# EAGLE board robo1rev2 (EAGLE 8.2.1)
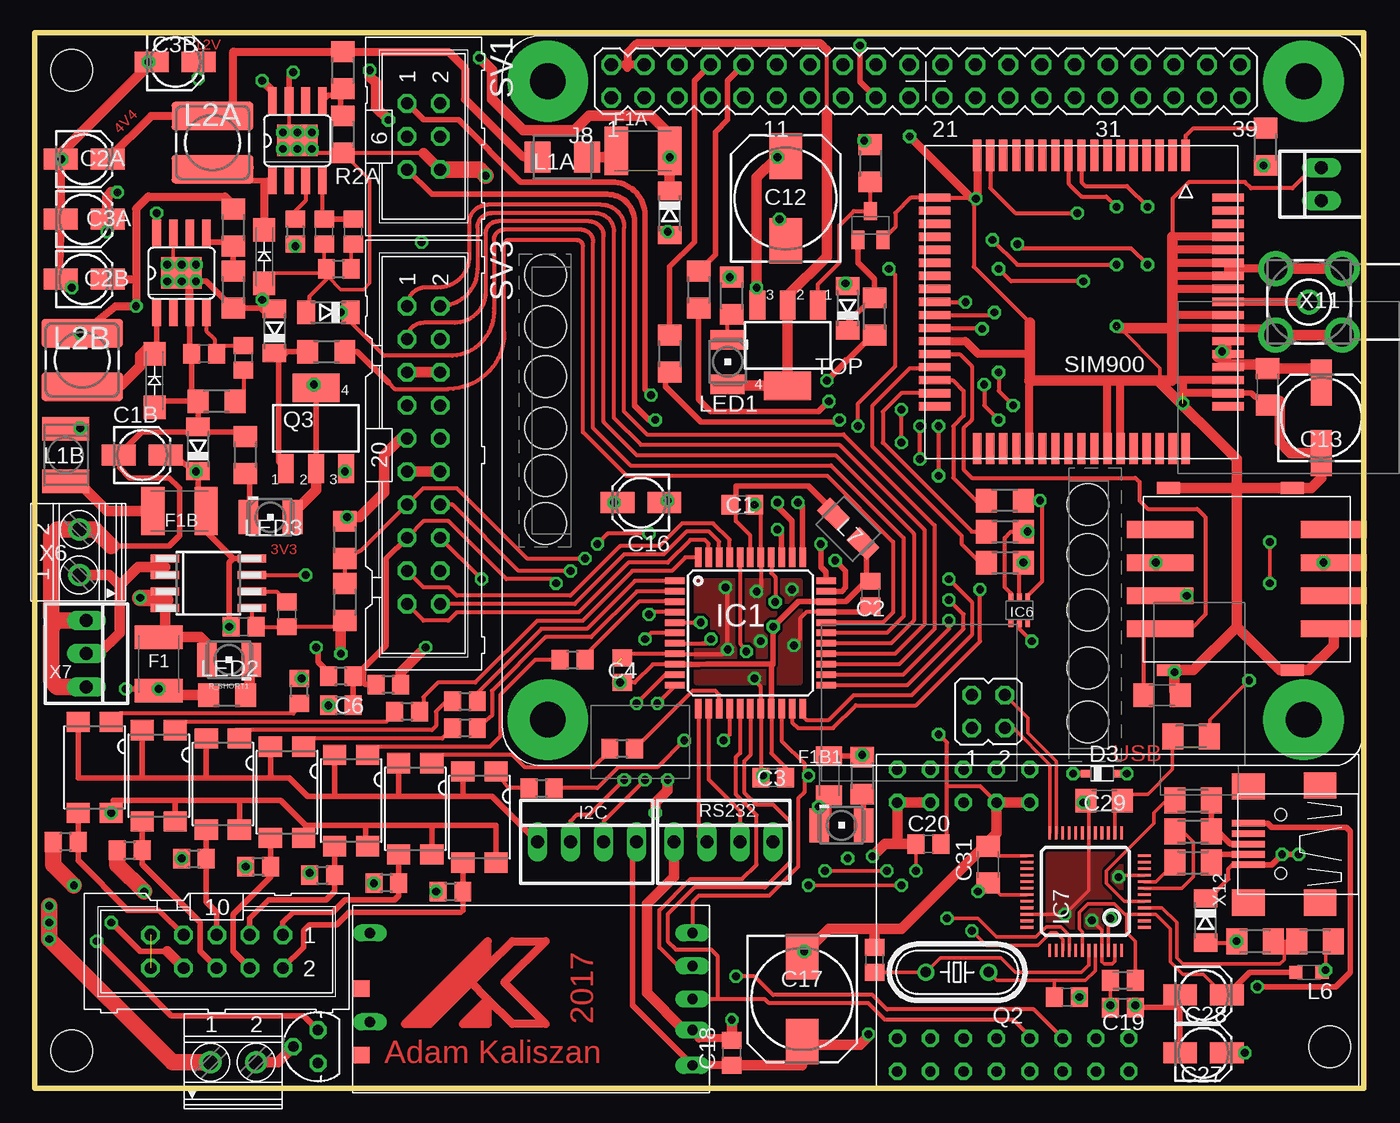
[diagram p2: board, top side]
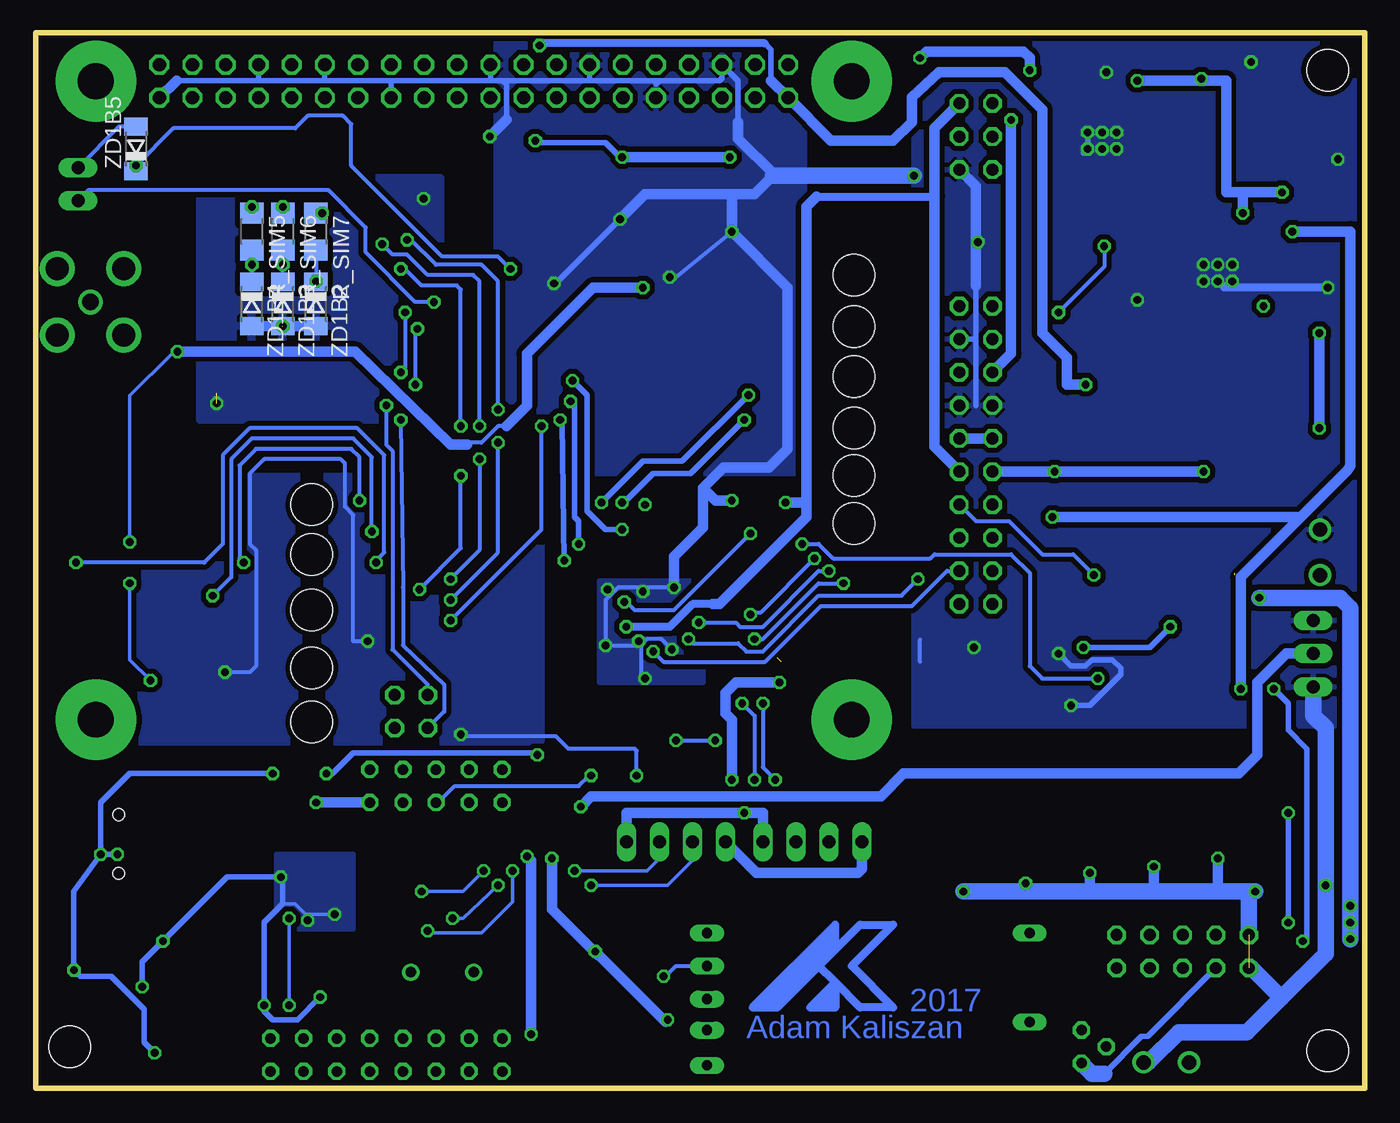
[diagram p3: board, bottom side, seen from below]

Size 102 x 81 mm. Coordinates in mm from the lower left corner, seen from the top.
Outline: 0,0 102,0 102,81 0,81 0,0
Copper layers (1*16): Top 0.035mm / dielectric 1.5mm / Bottom 0.035mm
Design rules "default *": minimum track width 10mil, minimum drill 22mil, track to track 8mil, track to pad 8mil, pad to pad 8mil, via to via 8mil, smd to smd 0mil, copper to edge 8mil, drill to drill 8mil, minimum pad ring 10mil, minimum via ring 8mil, stop-mask expansion 4mil, vias tented up to drill 10mil, thermal gap 10mil
Holes 3.2 mm at 2.86,78.11 2.86,2.86 99.38,3.17 39.21,62.39 39.21,58.42 39.21,54.61 39.21,50.64 39.21,46.99 39.21,43.34 80.8,44.77 80.8,40.96 80.8,36.67 80.8,32.23 80.8,28.1

## Footprints (pad centres in the part's own frame; a part is rotated, then mirrored left to right if it is on the bottom)
C0805 = smd 1.3 x 1.5: 1 -0.95,0; 2 0.95,0
153CLV-0405 = smd 2.6 x 1.6: + 1.8,0; - -1.8,0
C1206 = smd 1.6 x 1.8: 1 -1.4,0; 2 1.4,0
140CLH-0810 = smd 3.5 x 2.5: + 3.25,0; - -3.25,0
153CLV-0605 = smd 3.5 x 1.6: + 2.7,0; - -2.7,0
SMA-DO214AC = smd 1.8 x 1.7: A -2.05,0; K 2.05,0
SOD323_ST = smd 0.8 x 0.6: A 1.25,0; C -1.25,0
C1812K = smd 1.8 x 3.7: 1 -2.05,0; 2 2.05,0
C1206K = smd 1.5 x 2: 1 -1.5,0; 2 1.5,0
22-23-2041 = drill 1 long: 1 -3.81,0; 2 -1.27,0; 3 1.27,0; 4 3.81,0
TQFP44 = smd 1.5 x 0.5: 1 -5.8,4; 2 -5.8,3.2; 3 -5.8,2.4; 4 -5.8,1.6; 5 -5.8,0.8; 6 -5.8,0; 7 -5.8,-0.8; 8 -5.8,-1.6; 9 -5.8,-2.4; 10 -5.8,-3.2; 11 -5.8,-4; 23 5.8,-4; 24 5.8,-3.2; 25 5.8,-2.4; 26 5.8,-1.6; 27 5.8,-0.8; 28 5.8,0; 29 5.8,0.8; 30 5.8,1.6; 31 5.8,2.4; 32 5.8,3.2; 33 5.8,4 | smd 0.5 x 1.5: 12 -4,-5.8; 13 -3.2,-5.8; 14 -2.4,-5.8; 15 -1.6,-5.8; 16 -0.8,-5.8; 17 0,-5.8; 18 0.8,-5.8; 19 1.6,-5.8; 20 2.4,-5.8; 21 3.2,-5.8; 22 4,-5.8; 34 4,5.8; 35 3.2,5.8; 36 2.4,5.8; 37 1.6,5.8; 38 0.8,5.8; 39 0,5.8; 40 -0.8,5.8; 41 -1.6,5.8; 42 -2.4,5.8; 43 -3.2,5.8; 44 -4,5.8
SIM900 = smd 2.413 x 0.635: 1 -11.25,8; 2 -11.25,7; 3 -11.25,6; 4 -11.25,5; 5 -11.25,4; 6 -11.25,3; 7 -11.25,2; 8 -11.25,1; 9 -11.25,0; 10 -11.25,-1; 11 -11.25,-2; 12 -11.25,-3; 13 -11.25,-4; 14 -11.25,-5; 15 -11.25,-6; 16 -11.25,-7; 17 -11.25,-8; 35 11.25,-8; 36 11.25,-7; 37 11.25,-6; 38 11.25,-5; 39 11.25,-4; 40 11.25,-3; 41 11.25,-2; 42 11.25,-1; 43 11.25,0; 44 11.25,1; 45 11.25,2; 46 11.25,3; 47 11.25,4; 48 11.25,5; 49 11.25,6; 50 11.25,7; 51 11.25,8 | smd 0.635 x 2.413: 18 -8,-11.25; 19 -7,-11.25; 20 -6,-11.25; 21 -5,-11.25; 22 -4,-11.25; 23 -3,-11.25; 24 -2,-11.25; 25 -1,-11.25; 26 0,-11.25; 27 1,-11.25; 28 2,-11.25; 29 3,-11.25; 30 4,-11.25; 31 5,-11.25; 32 6,-11.25; 33 7,-11.25; 34 8,-11.25; 52 8,11.25; 53 7,11.25; 54 6,11.25; 55 5,11.25; 56 4,11.25; 57 3,11.25; 58 2,11.25; 59 1,11.25; 60 0,11.25; 61 -1,11.25; 62 -2,11.25; 63 -3,11.25; 64 -4,11.25; 65 -5,11.25; 66 -6,11.25; 67 -7,11.25; 68 -8,11.25
HSOP8-PAD = smd 0.66 x 2.032: 1 -1.905,-3.073; 2 -0.635,-3.073; 3 0.635,-3.073; 4 1.905,-3.073; 5 1.905,3.073; 6 0.635,3.073; 7 -0.635,3.073; 8 -1.905,3.073 | smd 3.1 x 2.41: P 0,0
78LXX = drill 0.813 octagon: GND 0,1.905; IN 1.27,0; OUT -1.27,0
SC-70-6 = smd 0.35 x 0.5: 1 -0.65,-1.05; 2 0,-1.05; 3 0.65,-1.05; 4 0.65,1.05; 5 0,1.05; 6 -0.65,1.05
LQFP = smd 0.2 x 1: 1 -2.75,-4.5; 2 -2.25,-4.5; 3 -1.75,-4.5; 4 -1.25,-4.5; 5 -0.75,-4.5; 6 -0.25,-4.5; 7 0.25,-4.5; 8 0.75,-4.5; 9 1.25,-4.5; 10 1.75,-4.5; 11 2.25,-4.5; 12 2.75,-4.5; 25 2.75,4.5; 26 2.25,4.5; 27 1.75,4.5; 28 1.25,4.5; 29 0.75,4.5; 30 0.25,4.5; 31 -0.25,4.5; 32 -0.75,4.5; 33 -1.25,4.5; 34 -1.75,4.5; 35 -2.25,4.5; 36 -2.75,4.5 | smd 1 x 0.2: 13 4.5,-2.75; 14 4.5,-2.25; 15 4.5,-1.75; 16 4.5,-1.25; 17 4.5,-0.75; 18 4.5,-0.25; 19 4.5,0.25; 20 4.5,0.75; 21 4.5,1.25; 22 4.5,1.75; 23 4.5,2.25; 24 4.5,2.75; 37 -4.5,2.75; 38 -4.5,2.25; 39 -4.5,1.75; 40 -4.5,1.25; 41 -4.5,0.75; 42 -4.5,0.25; 43 -4.5,-0.25; 44 -4.5,-0.75; 45 -4.5,-1.25; 46 -4.5,-1.75; 47 -4.5,-2.25; 48 -4.5,-2.75
JP2Q = drill 0.914 octagon: 1 -1.27,-1.27; 2 1.27,-1.27; 3 -1.27,1.27; 4 1.27,1.27
L4532M = smd 2 x 2.4: 1 -1.9,0; 2 1.9,0
L4532P = smd 1.8 x 3.6: 1 -2,0; 2 2,0
POWER-CHOKE_WE-TPC = smd 6.3 x 2.2: 1 0,2.05; 2 0,-2.05
L2012C = smd 1 x 1: 1 -1,0; 2 1,0
L4035M = smd 2.2 x 1.4: 1 -1.6,0; 2 1.6,0
PLCC2 = smd 2.6 x 1.5: A 0,1.7; C 0,-1.7
SMD4 = smd 1.78 x 1.55: 1 -1.27,-3.5; 2 1.27,-3.5; 3 1.27,3.5; 4 -1.27,3.5
R1206 = smd 1.6 x 1.803: 1 -1.422,0; 2 1.422,0
RASPBERRY_PI_APLUS_TPLACE = drill 1.016 octagon: 1 8.37,51.23; 2 8.37,53.77; 3 10.91,51.23; 4 10.91,53.77; 5 13.45,51.23; 6 13.45,53.77; 7 15.99,51.23; 8 15.99,53.77; 9 18.53,51.23; 10 18.53,53.77; 11 21.07,51.23; 12 21.07,53.77; 13 23.61,51.23; 14 23.61,53.77; 15 26.15,51.23; 16 26.15,53.77; 17 28.69,51.23; 18 28.69,53.77; 19 31.23,51.23; 20 31.23,53.77; 21 33.77,51.23; 22 33.77,53.77; 23 36.31,51.23; 24 36.31,53.77; 25 38.85,51.23; 26 38.85,53.77; 27 41.39,51.23; 28 41.39,53.77; 29 43.93,51.23; 30 43.93,53.77; 31 46.47,51.23; 32 46.47,53.77; 33 49.01,51.23; 34 49.01,53.77; 35 51.55,51.23; 36 51.55,53.77; 37 54.09,51.23; 38 54.09,53.77; 39 56.63,51.23; 40 56.63,53.77 | drill 2.75 pad 6.2: PE_BL 3.5,3.5; PE_BR 61.5,3.5; PE_TL 3.5,52.5; PE_TR 61.5,52.5
SOT23-BEC = smd 1 x 1.4: B -0.95,-1.1; C 0,1.1; E 0.95,-1.1
HC49/S = drill 0.813: 1 -2.413,0; 2 2.413,0
SOT223 = smd 1.219 x 2.235: 1 -2.311,-3.099; 2 0,-3.099; 3 2.311,-3.099 | smd 3.6 x 2.2: 4 0,3.099
M1206 = smd 1.6 x 2: 1 -1.4,0; 2 1.4,0
R0805 = smd 1.3 x 1.5: 1 -0.95,0; 2 0.95,0
M0805 = smd 1.3 x 1.6: 1 -0.95,0; 2 0.95,0
ML6 = drill 0.914 octagon: 1 -2.54,-1.27; 2 -2.54,1.27; 3 0,-1.27; 4 0,1.27; 5 2.54,-1.27; 6 2.54,1.27
ML10 = drill 0.914 octagon: 1 -5.08,-1.27; 2 -5.08,1.27; 3 -2.54,-1.27; 4 -2.54,1.27; 5 0,-1.27; 6 0,1.27; 7 2.54,-1.27; 8 2.54,1.27; 9 5.08,-1.27; 10 5.08,1.27
ML20 = drill 0.914 octagon: 1 -11.43,-1.27; 2 -11.43,1.27; 3 -8.89,-1.27; 4 -8.89,1.27; 5 -6.35,-1.27; 6 -6.35,1.27; 7 -3.81,-1.27; 8 -3.81,1.27; 9 -1.27,-1.27; 10 -1.27,1.27; 11 1.27,-1.27; 12 1.27,1.27; 13 3.81,-1.27; 14 3.81,1.27; 15 6.35,-1.27; 16 6.35,1.27; 17 8.89,-1.27; 18 8.89,1.27; 19 11.43,-1.27; 20 11.43,1.27
HC-12 = drill 0.8 long: P$1 -12.383,5.08; P$2 -12.383,2.381; P$3 -12.383,0; P$4 -12.383,-2.54; P$5 -12.383,-5.08; P$6 12.383,1.746; P$9 12.383,-5.08 | smd 1.27 x 1.27: P$7 13.018,4.286; P$8 13.018,-0.794
XCORE2530 = drill 0.8 octagon: P$1 1.587,1.27; P$1B 1.587,21.907; P$2 1.587,3.81; P$2B 1.587,24.448; P$3 4.128,1.27; P$3B 4.128,21.907; P$4 4.128,3.81; P$4B 4.128,24.448; P$5 6.668,1.27; P$5B 6.668,21.907; P$6 6.668,3.81; P$6B 6.668,24.448; P$7 9.207,1.27; P$7B 9.207,21.907; P$8 9.207,3.81; P$8B 9.207,24.448; P$9 11.748,1.27; P$9B 11.748,21.907; P$10 11.748,3.81; P$10B 11.748,24.448; P$11 14.287,1.27; P$12 14.287,3.81; P$13 16.828,1.27; P$14 16.828,3.81; P$15 19.367,1.27; P$16 19.367,3.81
115R-BCA0 = smd 5.08 x 1.27: C1 1.27,0; C2 1.27,2.54; C3 1.27,5.08; C4 1.27,7.62; C5 14.605,0; C6 14.605,2.54; C7 14.605,5.08; C8 14.605,7.62 | smd 1.778 x 0.914: P$1 1.905,10.795; P$2 1.905,-3.175; P$3 11.43,-3.175; P$4 11.43,10.795
SO-08M = smd 0.6 x 2.2: 1 -1.905,-3.33; 2 -0.635,-3.33; 3 0.635,-3.33; 4 1.905,-3.33; 5 1.905,3.33; 6 0.635,3.33; 7 -0.635,3.33; 8 -1.905,3.33
1751248 = drill 1.1 pad 1.7: 1 -1.75,-0.1; 2 1.75,-0.1
22-23-2031 = drill 1 long: 1 -2.54,0; 2 0,0; 3 2.54,0
22-23-2021 = drill 1 long: 1 -1.27,0; 2 1.27,0
BU-SMA-H = drill 1.27: 1 0,0 | drill 1.778: 2 -2.55,2.55; 3 2.55,2.55; 4 2.55,-2.55; 5 -2.55,-2.55
USB-M-S1 = smd 2.5 x 0.5: D+ 2.75,0; D- 2.75,0.8; GND 2.75,-1.6; ID 2.75,-0.8; VBUS 2.75,1.6 | smd 2.5 x 2: GND@1 -2.75,-4.5; GND@2 -2.75,4.5; GND@3 2.75,-4.4; GND@4 2.75,4.5 | hole 0.9: 0.25,2.25; 0.25,-2.25
SOD80C = smd 1.4 x 1.8: A 1.7,0; C -1.7,0

## Placement (x,y rotation side)
C1  [C0805]  54.29,44.77 0 top
C1B  [153CLV-0405]  8.26,48.58 0 top
C2  [C0805]  64.14,37.94 270 top
C2A  [153CLV-0405]  3.81,71.28 0 top
C2B  [153CLV-0405]  3.81,62.07 0 top
C3  [C0805]  56.67,23.81 180 top
C3A  [153CLV-0405]  3.81,66.67 0 top
C3B  [153CLV-0405]  10.79,78.74 0 top
C4  [C0805]  45.09,32.07 90 top
C4A  22nF  [C0805]  24.45,65.72 270 top
C4B  22nF  [C0805]  16.03,56.04 270 top
C5  100nF  [C1206]  94.61,53.82 270 top
C5A  220pF  [C0805]  22.23,65.72 270 top
C5B  220pF  [C0805]  13.02,56.36 180 top
C6  [C0805]  23.5,29.37 180 top
C12  [140CLH-0810]  57.63,68.26 90 top
C13  [153CLV-0605]  98.74,51.44 90 top
C16  [153CLV-0405]  46.51,44.93 180 top
C17  [140CLH-0810]  58.9,6.83 270 top
C18  [C0805]  53.5,2.7 90 top
C19  [C0805]  83.5,6.19 0 top
C20  [C0805]  68.58,18.73 0 top
C21  100nF  [C1206]  86.52,30.16 0 top
C27  [153CLV-0405]  89.69,2.7 0 top
C28  [153CLV-0405]  89.69,7.14 0 top
C29  [C1206]  82.07,22.07 180 top
C31  [C1206]  73.18,17.14 90 top
C33  12pf  [C0805]  64.45,9.84 90 top
C34  12pf  [C0805]  79.22,6.99 0 top
CI1  100nF  [C0805]  16.03,35.4 0 top
CI2  1nF  [C0805]  19.37,36.35 270 top
D1A  B350A-13-F  [SMA-DO214AC]  17.62,63.82 90 top
D1B  B350A-13-F  [SMA-DO214AC]  9.21,54.29 90 top
D3  BAT60J  [SOD323_ST]  81.92,24.13 0 top
F1  [C1812K]  9.53,32.54 270 top
F1A  [C1812K]  46.67,71.91 0 top
F1B  [C1812K]  11.11,44.29 0 top
F1B1  [C1206K]  60.96,23.97 270 top
I2C  [22-23-2041]  42.39,18.89 0 top
IC1  XMEGA16A4A  [TQFP44]  54.93,34.92 0 top
IC2  SIM900  [SIM900]  80.33,60.33 270 top
IC3  L5973D  [HSOP8-PAD]  20.16,72.71 0 top
IC4  L5973D  [HSOP8-PAD]  11.27,62.55 0 top
IC5  [78LXX]  21.75,3.17 90 top
IC6  SMF05C  [SC-70-6]  75.56,36.67 0 top
IC7  [LQFP]  80.64,15.08 90 top
JP_CPU1  [JP2Q]  73.18,28.89 0 top
L1A  47@1000  [L4532M]  40.48,71.44 0 top
L1B  47@1000  [L4532P]  2.38,48.58 270 top
L2A  15µH  [POWER-CHOKE_WE-TPC]  13.65,72.55 0 top
L2B  15µH  [POWER-CHOKE_WE-TPC]  3.65,55.88 0 top
L6  [L2012C]  97.79,8.89 0 top
L7  [L4035M]  62.44,42.91 135 top
LED1  [PLCC2]  53.18,55.72 180 top
LED2  [PLCC2]  14.92,32.86 90 top
LED3  [PLCC2]  18.1,43.81 270 top
LED_USB_FAULT  [PLCC2]  61.91,20.16 270 top
OK_A1  LTV816S  [SMD4]  24.29,22.07 180 top
OK_A2  LTV816S  [SMD4]  14.45,23.34 180 top
OK_B1  LTV816S  [SMD4]  19.37,22.7 180 top
OK_B2  LTV816S  [SMD4]  9.53,23.97 180 top
OK_HEN  LTV816S  [SMD4]  4.6,24.61 180 top
OK_PWMA  LTV816S  [SMD4]  34.13,20.8 180 top
OK_PWMB  LTV816S  [SMD4]  29.21,21.43 180 top
P_PDIV2  2k2  [R1206]  23.81,37.31 90 top
PCB1  RASPBERRY_PI_B+TPLACE_A  [RASPBERRY_PI_APLUS_TPLACE]  35.88,24.77 0 top
Q1  BC817  [SOT23-BEC]  64.14,66.2 0 top
Q2  [HC49/S]  70.8,8.89 180 top
Q3  BSP170P  [SOT223]  21.59,50.64 0 top
Q4  BSP170P  [SOT223]  57.78,56.99 180 top
R1  27  [M1206]  88.9,17.3 180 top
R1A  8k2  [R1206]  23.65,78.11 90 top
R1B  5k6  [R1206]  15.24,66.04 90 top
R1RPI  56k  [R1206]  64.45,59.21 270 top
R2  27  [M1206]  88.9,19.68 180 top
R2A  3k3  [R1206]  23.65,73.18 90 top
R2B  3k3  [R1206]  15.24,61.28 90 top
R2RPI  56k  [R1206]  64.14,70.96 90 top
R3  1k5  [M1206]  88.9,22.07 180 top
R3A  4k7  [R0805]  23.34,62.87 0 top
R3B  4k7  [R1206]  13.97,52.7 0 top
R3RPI  1k  [R1206]  53.5,60.8 270 top
R3RPI1  1k  [R1206]  16.19,48.58 270 top
R3RPI2  1k  [R1206]  48.74,56.36 90 top
R3RPI3  1k  [R1206]  50.96,61.28 90 top
R4  470  [M0805]  83.5,8.26 0 top
R4A  3k3  [R0805]  20,65.72 270 top
R5  4k7  [M1206]  98.27,11.27 0 top
R6  10k  [M1206]  93.66,11.27 0 top
R7  0  [M1206]  88.74,26.99 0 top
R_A1IN1  1k  [R0805]  41.27,32.86 0 top
R_A1IN2  1k  [R0805]  22.07,16.35 0 top
R_A2IN1  1k  [R0805]  33.02,29.69 0 top
R_A2IN2  1k  [R0805]  12.22,17.62 0 top
R_B1IN1  1k  [R0805]  28.57,28.89 180 top
R_B1IN2  1k  [R0805]  17.14,16.99 180 top
R_B2IN1  1k  [R0805]  33.02,27.62 180 top
R_B2IN2  1k  [R0805]  7.3,18.26 0 top
R_HEN1  1k  [R0805]  20.32,30.48 90 top
R_HEN2  1k  [R0805]  2.38,18.89 180 top
R_PDIV1  56k  [R1206]  23.81,42.07 90 top
R_PWMA1  1k  [R0805]  45.09,26.04 180 top
R_PWMA2  1k  [R0805]  26.99,15.72 180 top
R_PWMB1  1k  [R0805]  38.89,23.02 0 top
R_PWMB2  1k  [R0805]  31.91,15.08 0 top
R_PWR1  56k  [R0805]  23.5,31.59 180 top
R_PWR2  12k  [R0805]  27.15,30.96 180 top
R_RPI2  56k  [R1206]  22.38,56.52 180 top
R_SHORT1  1k  [R1206]  14.76,30.16 180 top
R_SHORT_USB  1k  [R1206]  63.5,23.97 90 top
R_SIM1  22  [R1206]  74.45,40.32 180 top
R_SIM2  22  [R1206]  74.45,42.7 180 top
R_SIM3  22  [R1206]  74.45,45.09 0 top
R_SIM4  1k  [R1206]  94.46,72.23 270 top
R_SIM5  1k  [R1206]  85.41,65.72 270 bottom
R_SIM6  1k  [R1206]  83.03,65.72 270 bottom
R_SIM7  1k  [R1206]  80.49,65.72 270 bottom
RS232  [22-23-2041]  52.86,18.89 0 top
SV1  [ML6]  29.84,73.03 270 top
SV2  [ML10]  13.97,10.48 180 top
SV3  [ML20]  29.84,48.58 270 top
U$3  HC-12  [HC-12]  38.1,6.83 180 top
U$4  XCORE2530  [XCORE2530]  64.61,0 0 top
U$5  [LOGO]  34.77,5.56 0 top
U$6  [LOGO]  40.64,6.83 0 bottom
U$7  SCU-W0822XR-06115R-BCA0  [115R-BCA0]  85.09,35.24 0 top
U$8  ACS712SO8  [SO-08M]  13.34,38.73 270 top
X2  [1751248]  15.24,2.06 0 top
X6  [1751248]  3.33,41.12 90 top
X7  [22-23-2031]  3.97,33.34 270 top
X9  22-23-2021  [22-23-2021]  98.74,69.37 90 top
X11  BU-SMA-H  [BU-SMA-H]  97.79,60.33 0 top
X12  [USB-M-S1]  95.89,18.73 180 top
ZD1A  5v1  [SOD80C]  48.74,67.15 270 top
ZD1B  3v6  [SOD80C]  12.54,49.05 90 top
ZD1B2  3v6  [SOD80C]  80.49,60.17 270 bottom
ZD1B3  3v6  [SOD80C]  83.03,60.17 270 bottom
ZD1B4  3v6  [SOD80C]  85.41,60.17 270 bottom
ZD1B5  3v6  [SOD80C]  94.3,72.07 90 bottom
ZD1B14  3v6  [SOD80C]  62.39,59.85 90 top
ZD1B15  3v6  [SOD80C]  18.41,58.1 90 top
ZD2A  3v6  [SOD80C]  22.54,59.53 180 top
ZD_USB  5v6  [SOD80C]  89.85,12.86 270 top

## Tracks (layer width: path | path; a pad name or v marks a point on that pad's centre or on a via)
+3V3  (via drill 0.6)
  Top 0.254: v72.39,15.08 73.05,15.74 C31.1 74.1,14.83 IC7.31 | v67.63,16.67 C20.1
  Top 0.305: IC1.9 47.45,32.52 46.04,31.11 C4.1 | C4.1 v44.93,31.11 44.45,31.11 C4.1 | IC1.19 56.53,25.7 56.52,25.72 57.78,24.45 C3.1 | v63.98,4.13 63.98,3.97 | 59.14,3.33 C17.+ 58.82,3.42 58.9,3.17 | C18.1 | 14.92,34.93 CI1.1 | v23.81,47.31 23.9,47.31 Q3.3
  Top 0.406: 63.82,38.89 62.25,37.33 IC1.31 58.6,37.33 v56.67,35.4 56.67,32.54 | 63.82,38.89 C2.1 63.82,38.89 | IC1.9 50.98,32.52 51.59,32.54 56.67,32.54 | IC1.19 56.53,32.53 56.59,32.46 56.67,32.54 | 63.82,38.89 63.82,41.27 63.75,41.43 L7.1 | U$8.8 15.24,40.64 | 15.24,40.64 14.92,40.32 v14.92,35.4 | v14.92,35.4 14.92,34.93 | ZD1B.C 12.54,45.31 | 12.54,45.24 12.54,45.31 | 12.54,45.31 F1B.2 13.16,42.72 15.24,40.64 | C1B.+ 10.64,48.58 12.22,47.31 | I2C.4 45.88,18.57 45.88,6.35 U$3.P$1 | R_PWR1.2 22.55,31.91 21.75,32.7 21.75,33.66 v21.59,33.81 | v14.92,35.4 14.92,35.24 CI1.1
  Top 0.61: C18.1 U$3.P$1
  Top 0.813: C18.1 58.9,1.75 58.9,3.17 | 66.2,18.73 U$4.P$1B U$4.P$3B | 66.2,18.73 65.25,18.73 v64.29,17.78 | 63.98,3.97 63.34,3.33 59.14,3.33 | C20.1 66.2,18.73 | C16.+ v44.45,44.93 | ZD1B.C 12.34,47.31 v12.38,47.31 12.22,47.47 12.22,47.31 | SV3.11 SV3.12 | v47.62,21.11 47.62,21.91 48.58,22.86 v48.58,23.65
  Bottom 0.254: v72.39,15.08 69.22,15.08 v67.63,16.67
  Bottom 0.305: 23.98,47.31 v23.81,47.31
  Bottom 0.406: v21.59,33.81 16.51,33.81 v14.92,35.4
  Bottom 0.61: 42.07,68.42 33.02,68.42 | 50.01,37.15 51.59,37.15 53.34,35.4 v56.67,35.4
  Bottom 0.813: SV1.2 33.02,73.66 33.02,68.42 33.02,49.21 SV3.12 | v44.93,31.11 48.26,31.11 49.05,30.32 49.05,28.73 48.58,28.26 v48.58,23.65 | v64.29,17.78 63.98,17.46 v63.98,4.13 | 50.01,37.15 49.53,37.15 42.86,43.81 42.86,45.09 | 42.86,45.09 42.86,67.63 42.07,68.42 | v44.45,44.93 43.02,44.93 42.86,45.09 | v23.81,47.31 12.59,47.31 ZD1B.C 12.27,47.35 v12.38,47.31 | I2C.4 46.2,21.11 v47.62,21.11 56.67,21.11 RS232.4 | SV3.11 23.98,47.31
+4V4_BF
  Top 0.406: 23.5,79.53 R1A.2
  Top 0.61: 23.5,79.53 15.24,79.53 15.24,74.77 L2A.1 8.93,74.6 C2A.+ | R1A.2 31.76,79.53 33.02,78.26 33.02,75.88 37.47,71.44 L1A.1
+4V35  (via drill 0.6)
  Top 0.254: v94.77,38.73 v94.77,41.91 | v93.19,31.27 90.17,28.26 90.17,27.02 R7.2
  Top 0.406: C12.+ 57.63,72.55 | 63.97,72.55 R2RPI.2 63.81,72.71 v63.66,72.71 | 25.72,77.63 v25.72,78.11
  Top 0.61: 91.58,55.53 IC2.55 | IC2.55 IC2.56 IC2.57 | IC2.55 90.81,56.1
  Top 0.813: C12.+ 57.55,71.44 v56.99,71.44 55.4,69.85 v55.4,61.44 55.47,61.37 Q4.3 | ZD1A.C v48.74,71.44 48.72,71.44 F1A.2 48.72,73.2 47.31,74.61 42.55,74.61 41.43,73.5 37.47,73.5 35.08,75.88 35.08,78.11 v34.13,79.06 | 91.58,55.53 94.59,55.53 94.61,55.56 C5.1 98.74,55.22 C13.+ | 90.81,56.1 v91.12,56.52 | v27.15,74.3 26.19,75.25 26.19,77.15 25.72,77.63 | SV3.5 SV3.6
  Bottom 0.254: v93.19,31.27 94.77,32.86 v94.77,38.73 | v94.77,41.91 94.77,53.13 IC2.56 91.31,56.33 v91.12,56.52
  Bottom 0.305: 65.88,50.8 66.52,50.8 67.79,49.53 68.74,49.53 68.9,49.37
  Bottom 0.406: v56.99,71.44 57.15,71.44 58.26,72.55 63.5,72.55 v63.66,72.71
  Bottom 0.813: v48.74,71.44 v56.99,71.44 | 65.88,50.8 64.29,52.39 64.29,56.36 59.21,61.44 v55.4,61.44 | v91.12,56.52 77.47,56.52 70.17,49.37 68.9,49.37 | v27.15,74.3 27.15,56.36 SV3.5 | v25.72,78.11 25.72,79.06 26.19,79.53 33.66,79.53 v34.13,79.06
+12V  (via drill 0.6)
  Top 0.406: C3A.+ 5.56,67.63 | IC5.IN 20.64,5.56 10.48,5.56 v4.76,11.27 | v6.99,30.64 v9.53,30.64
  Top 0.61: 18.26,75.72 IC3.8 18.26,76.52 v17.46,77.31 | IC4.8 v9.37,67.15 | v12.54,77.47 12.54,78.69 C3B.+
  Top 0.813: v6.35,68.74 5.87,68.74 5.56,68.37 5.56,67.63 v5.56,65.72 | R_PDIV1.2 v23.97,43.81 24.92,43.81 26.83,45.72 26.83,48.58 28.1,49.85 SV3.9 | v9.53,30.64 F1.2 9.86,30.16 R_SHORT1.2
  Bottom 0.406: v4.76,11.27 4.45,11.59 4.45,26.04 5.87,27.46 5.87,29.53 v6.99,30.64
  Bottom 0.61: 10.64,77.31 v12.54,77.47
  Bottom 0.813: v9.37,67.15 9.37,68.74 | 9.37,68.74 10.64,68.74 10.64,77.31 v17.46,77.31 | v6.35,68.74 9.37,68.74 | v5.56,65.72 1.11,65.72 1.11,47.72 1.33,47.4 4.92,43.81 | v23.97,43.81 4.92,43.81 | 4.92,43.81 9.53,39.21 v9.53,30.64 | SV3.9 SV3.10
A1_IN
  Top 0.305: R_A1IN1.1 38.42,32.86 35.72,30.16 35.72,26.99 34.92,26.19 26.19,26.19 25.55,26.19 25.24,25.88 OK_A1.1
A2_IN
  Top 0.305: R_A2IN1.1 31.59,29.69 30.8,28.89 30.8,27.78 30.48,27.46 15.4,27.46 OK_A2.1
A_RX
  Top 0.254: JP_CPU1.4 76.2,28.42 76.2,27.25 78.39,25.05 IC7.23
A_TX
  Top 0.254: IC7.24 77.89,24.82 75.09,27.62 JP_CPU1.2
AVCC
  Top 0.305: IC1.39 54.93,42.39 53.82,43.5 53.82,44.77 C1.1
  Top 0.406: C1.1 53.66,44.61 53.82,44.77 53.82,46.2 59.37,46.2 61.82,43.74 61.73,43.65 L7.2
B1_IN
  Top 0.305: R_B1IN1.2 27.62,28.74 26.99,28.1 11.11,28.1 OK_B2.1
B2_IN
  Top 0.305: R_B2IN1.2 31.27,26.83 20.32,26.83 OK_B1.1
COMP1
  Top 0.305: IC3.4 22.07,66.83 C5A.1
  Top 0.406: C5A.1 C4A.1
COMP2
  Top 0.305: IC4.4 13.18,58.1 13.81,57.47 13.81,56.99 | C5B.1 14.29,56.67 13.81,56.99 | 13.81,56.99 C4B.1
CPU_RST  (via drill 0.6)
  Top 0.406: IC1.35 58.13,43.16 58.1,43.5 56.99,44.61 v56.99,44.93 | v47.62,51.28 47.15,51.28 46.04,52.39 46.04,53.34 46.04,66.52 arc90 43.97,68.58 30.48,68.58 SV1.5
  Bottom 0.406: v56.99,44.93 56.83,44.93 54.61,47.15 51.75,47.15 v47.62,51.28
DBG_RX  (via drill 0.6)
  Top 0.305: IC2.28 72.61,58.33 v72.71,58.26 | v72.87,53.98 72.87,52.39 v73.98,51.28
  Bottom 0.305: v72.71,58.26 72.87,58.1 v72.87,53.98 | v73.98,51.28 73.98,51.12 73.82,38.42 73.82,33.97 70.64,30.96 70.64,28.89 JP_CPU1.1
DBG_TX  (via drill 0.6)
  Top 0.305: IC2.27 73.45,59.33 v73.66,59.53 | v73.98,54.93 73.98,53.5 v75.09,52.39
  Bottom 0.305: v73.66,59.53 73.66,55.24 v73.98,54.93 | v75.09,52.39 75.09,49.37 74.61,48.9 74.61,33.66 71.91,30.96 JP_CPU1.3
EXT_RX  (via drill 0.6)
  Top 0.254: v59.37,15.56 v66.52,15.56 | IC7.40 79.39,11.73 78.74,12.38 77.63,12.38 76.83,11.59 73.82,11.59 72.39,13.02 v70.01,13.02
  Top 0.305: IC1.12 50.93,19.34 RS232.2
  Bottom 0.254: v66.52,15.56 69.22,13.02 v70.01,13.02 | v59.37,15.56 53.5,15.56 51.59,17.46 RS232.2
EXT_TX  (via drill 0.6)
  Top 0.254: v60.64,16.67 v65.41,16.67 | IC7.39 78.9,11.43 78.42,11.91 77.95,11.91 76.99,10.95 73.03,10.95 v71.91,12.06
  Top 0.305: IC1.13 51.73,23.68 54.13,21.27 RS232.3
  Bottom 0.254: v65.41,16.67 65.41,14.29 67.79,11.91 71.75,11.91 v71.91,12.06 | v60.64,16.67 55.09,16.67 54.13,17.62 RS232.3
FT_AVCC  (via drill 0.6)
  Top 0.254: R4.1 C19.1 v82.55,6.35 | IC7.46 82.39,12.86 v82.55,13.02
  Bottom 0.254: v82.55,6.35 v82.55,13.02
FT_RST
  Top 0.254: R5.1 96.04,11.27 | 96.04,11.27 R6.2 | IC7.4 86.5,13.83 87.63,12.7 87.63,10 88.11,9.53 95.57,9.53 95.89,9.84 95.89,11.11 96.04,11.27
FT_VCC
  Top 0.254: 83.82,13.33 IC7.3 86.05,13.33 86.04,13.34 87.15,12.22 87.15,9.68 88.11,8.73 89.69,8.73 90.91,7.51 91.86,7.51 | 83.82,13.33 83.67,13.33 82.87,14.13 80.8,14.13 80.17,13.49 80.17,12.22 80.39,12 IC7.42 | R4.2 84.45,11.27 83.82,11.91 83.82,13.33
  Top 0.406: L6.1 93.24,8.89 91.86,7.51 C28.+
FT_XIN
  Top 0.254: IC7.43 80.89,9.43 80.87,9.43 80.33,8.89 75.25,8.89 74.14,10 69.5,10 Q2.2 C33.1
FT_XOUT
  Top 0.254: IC7.44 81.39,9.01 80.64,8.26 78.26,8.26 | 78.26,8.26 73.85,8.26 Q2.1 | C34.1 78.27,8.25 78.26,8.26
GND  (via drill 0.6)  (5 unrouted)
  Top 0.254: 13.02,61.91 v12.38,61.91 11.91,61.91 | 17.62,59.86 D1A.A 18.41,62.55 22.07,62.55 R3A.1 | v21.27,72.07 21.58,71.76 R2A.1 25.72,69.7 25.72,61.75 25.24,61.28 23.5,61.28 22.54,62.23 22.39,62.38 R3A.1 | IC3.7 19.53,73.82 v19.05,73.34 | 19.37,72.71 19.53,72.71 v20.16,73.34 | IC3.P v20.16,72.07 v19.05,72.07 | IC4.7 10.64,63.18 v10.16,63.18 v11.27,63.18 | v11.27,63.18 v12.38,63.18 | v11.27,63.18 IC4.P v11.27,61.91 v10.16,61.91 | 10.02,52.7 D1B.A | R3A.1 22.23,63.02 C5A.2 | C19.2 v84.45,6.35 | v81.12,12.86 81.89,12.09 IC7.45 81.89,9.7 82.07,9.53 82.71,9.53 82.89,9.71 IC7.47 | IC7.34 v79.05,13.33 v79.06,13.34 80.89,15.17 IC7.18 80.89,22.16 C29.2 v80.49,21.91 | v92.23,11.27 92.23,11.24 R6.1 | IC7.9 83.32,16.33 | IC7.25 73.9,17.83 C31.2 73.18,18.57 | 86.36,54.13 86.36,55.24 83.19,58.42 83.03,58.42 | 64.45,12.06 64.29,12.22
  Top 0.305: C4.2 45.39,33.33 IC1.8 52.85,33.33 v53.18,33.66 53.18,38.26 v53.02,38.42 | v55.24,31.43 55.24,31.27 55.73,30.79 IC1.18 55.73,24.45 C3.2 v55.88,23.97 | C1.2 55.73,44.28 IC1.38 55.73,38.42 v55.4,38.1 | U$3.P$2 49.85,4.45 | IC1.30 59.23,36.52 58.74,36.04 58.74,34.45 v58.26,33.97 | 59.62,10.79 C17.- | C20.2 70.01,19.05 70.01,23.18 | 70.01,23.18 72.55,23.18 U$4.P$7B | 72.33,68.33 IC2.18 67.21,68.33 66.04,67.15 66.04,66.05 Q1.E | 72.39,68.1 72.07,67.79 72.07,63.02 76.36,58.74 | C21.2 88.29,30.35 87.47,30.48 | 87.47,32.07 v87.47,31.91 87.31,31.91 | 87.47,32.07 87.95,32.07 | X9.2 98.11,70.64 96.52,69.06 93.34,69.06 92.87,69.53 88.58,69.53 87.31,68.26 87.31,65.33 | IC6.2 75.56,35.24 v76.52,34.29 | 87.31,31.91 87.47,32.07 | 83.33,54.28 83.34,54.29 | C13.- 98.74,46.83 | U$7.P$3 95.57,32.07 | 87.31,31.91 87.15,31.91 U$7.P$2 | U$8.5 16.66,35.4 CI1.2 18.89,35.4 CI2.2 23.33,35.4 P_PDIV2.1 | R3RPI.1 53.51,62.38 v53.34,62.23 | 29.84,71.75 21.59,71.75 v21.27,72.07 | 22.54,62.23 21.07,60.76 21.07,59.6 ZD2A.A | 44.77,32.7 | ZD_USB.A 92.15,11.16 R6.1 | 70.01,23.18 70.01,26.51 v69.37,27.15
  Top 0.406: IC3.P 19.37,72.71 | 20.48,72.07 v20.16,72.07 | v21.27,73.34 v20.16,73.34 | v19.05,73.34 v19.05,72.07 | IC1.30 63.67,36.52 C2.2 | X12.GND 94.61,20.32 94.93,20 100.65,20 100.97,19.68 100.97,8.89 99.85,7.78 v93.82,7.78 | R6.1 92.26,11.88 | 83.32,16.33 v83.19,16.19 | IC2.53 92.08,53.33 92.08,53.34 93.34,53.34 93.66,53.02 94.14,53.02 94.77,52.39 94.61,52.39 C5.2 | IC3.7 19.53,77.63 v19.84,77.95 | 13.02,61.91 13.18,61.91 15.24,59.85 R2B.1 17.62,59.86 | IC4.3 11.91,56.67 C5B.2 12.06,55.25 C5B.2 12.07,53.19 R3B.1 | R3B.1 12.55,50.76 ZD1B.A | R3B.1 10.02,52.7 9.86,52.67 | ZD1B.A 12.34,50.75 11.91,50.32 8.2,50.32 C1B.- 6.51,48.52 6.51,47.62 7.3,46.83 10.32,46.83 11.11,46.04 11.11,42.39 10.32,41.59 5.87,41.59 | 2.38,61.44 2.33,61.44 C2B.- | R3RPI1.1 15.88,50.32 12.97,50.32 ZD1B.A | ZD1B14.A v62.23,61.75 | v84.45,6.35 84.61,6.19 87.89,6.19 | C34.2 80.17,6.67 C34.2 | C27.- 87.89,6.19 | 87.89,6.19 C28.- | OK_PWMB.2 27.94,22.38 | 27.94,22.38 32.86,22.38 | 32.86,22.38 35.08,22.38 I2C.1 | OK_A1.2 23.02,22.38 | 23.02,22.38 27.94,22.38 | 8.26,23.81 3.33,23.81 OK_HEN.2 3.5,28.11 3.97,28.57 | 8.26,23.81 OK_B2.2 | 13.18,23.81 8.26,23.81 | OK_B1.2 18.1,23.97 | 18.1,23.97 18.1,23.81 13.18,23.81 | 18.1,23.97 18.26,23.81 19.53,23.81 20.95,22.38 23.02,22.38 | OK_A2.2 13.18,23.81 | OK_PWMA.2 32.86,22.38 | C6.2 v22.54,29.37
  Top 0.61: 57.63,66.2 57.23,66.6 | 53.5,3.81 50.96,3.81 U$3.P$2 | 87.31,54.33 IC2.54 88.11,54.33 88.11,53.33 IC2.53 | 87.31,58.33 IC2.58 96.03,58.33 | IC2.61 87.36,61.33 | IC2.63 87.45,63.33 | IC2.65 87.31,65.33 | IC2.64 87.31,64.33 | 83.33,54.29 IC2.46 83.33,54.28 | IC2.45 82.33,54.29 | IC2.39 76.33,54.29 | IC2.29 71.42,57.33 72.39,56.36 76.36,56.36 | IC2.59 87.31,59.33 | 87.31,62.33 IC2.62 91.58,62.88 X11.2 | 68.6,71.58 v67.15,73.03 71.91,68.26 v72.23,68.26 72.33,68.36 IC2.17 | IC4.3 11.91,61.91 v11.27,61.91 | C2A.- C3A.- 1.85,61.97 2.38,61.44 v2.86,61.44 | 72.33,68.33 72.33,68.17 72.39,68.1
  Top 0.813: 49.85,4.45 46.99,7.3 46.99,14.13 49.05,16.19 RS232.1 | U$4.P$9B U$4.P$7B 73.82,19.53 72.95,18.65 | 72.95,18.65 66.52,12.22 64.29,12.22 60.96,12.22 59.53,10.79 59.62,10.79 | 53.5,3.81 C18.2 53.5,3.81 | v59.05,10.48 58.74,10.16 58.74,9.92 C17.- | 53.5,3.81 v53.5,5.24 | 87.31,58.33 87.31,54.33 87.28,54.29 83.34,54.29 83.33,54.29 82.33,54.29 76.36,54.29 | 96.03,58.33 X11.5 X11.4 | X11.3 X11.2 | 87.31,58.33 87.31,59.33 87.31,61.28 87.36,61.33 87.31,61.37 87.31,62.33 87.31,63.18 | 87.45,63.33 87.31,63.18 | 87.31,65.33 87.31,64.33 87.31,63.18 | C13.- 96.36,48.74 95.54,49.56 95.54,52.73 C5.2 | 76.33,54.29 76.36,54.29 | 76.36,58.75 76.36,58.74 76.36,56.36 76.36,54.29 | 87.47,30.48 v87.47,31.91 | U$7.C5 99.69,33.97 97.79,32.07 U$7.P$3 | 98.74,46.83 97.95,46.04 | 92.23,35.4 92.23,46.04 | 97.79,46.04 U$7.P$4 92.23,46.04 | 92.23,46.04 U$7.P$1 | 95.57,32.07 92.23,35.4 | v57.15,66.67 57.23,66.6 | 73.18,18.57 72.95,18.65 | ZD1A.A v48.58,65.72 | C12.- 57.63,66.2 | 87.31,58.33 83.17,58.33 ZD1B3.A | C16.- 48.42,44.93 v48.58,45.09 | SV1.6 29.84,71.75 | v23.5,33.34 23.5,35.24 23.33,35.4 | 72.33,68.33 72.29,68.33 v72.23,68.26 | 87.95,32.07 88.9,32.07 92.23,35.4 | 92.23,46.04 92.23,48.26 86.36,54.13 | C33.2 64.45,12.06 | X2.2 18.63,1.96 IC5.GND | R_A2IN2.1 | R_B1IN2.2 16.2,16.83 v16.19,16.99 | R_A1IN2.1 v21.12,16.51 v21.11,16.51 | R_PWMA2.2 26.04,16.03 R_PWMA2.2 | R_PWMB2.1 v30.8,15.08 | D1A.A 17.62,59.8 ZD1B15.A | C2A.- 2.01,71.75 C3B.- | R_PWR2.1 28.1,31.91 v30,33.81
  Top 1.27: v34.61,70.01 34.13,70.48 SV1.6 | X7.3 1.75,30.8 1.27,31.27 1.27,35.4 1.67,35.8 | 1.67,35.8 1.75,35.88 X7.1 | R_HEN2.2 1.43,17.14 v3.02,15.56 | R_B2IN2.1 6.35,17.14 v8.41,15.08 | 1.67,35.8 1.27,36.2 1.27,42.39 1.75,42.87 X6.2 4.6,42.87 5.87,41.59
  Bottom 0.254: 83.03,14.13 82.07,14.13 81.28,13.34 | v81.12,12.86 81.12,13.18 81.28,13.34 | v79.06,13.34 81.28,13.34 | v83.19,16.19 83.03,16.03
  Bottom 0.305: v53.18,33.66 53.98,34.45 55.09,34.45 55.56,33.97 | 55.56,33.97 55.56,31.75 v55.24,31.43 | 55.56,33.97 v58.26,33.97 58.26,37.47 57.31,38.42 55.72,38.42 v55.4,38.1 55.09,38.42 v53.02,38.42 | v76.52,34.29 77.63,34.29 77.63,43.97 78.26,44.61 78.26,47.94 78.58,48.26 84.45,48.26 85.57,47.15 85.57,41.75 85.09,41.27 85.09,32.38 85.57,31.91 v87.47,31.91 | v53.34,62.23 52.86,62.23 v48.58,65.72 | ZD1B5.A 95.61,73.77 X9.2 | 34.13,32.7 34.13,34.4 | v55.88,23.97 55.88,25.88 56.04,26.04 61.12,26.04 62.07,26.99 69.22,26.99 v69.37,27.15
  Bottom 0.406: 21.59,71.75 v21.27,72.07 v21.27,73.34 | 54.13,77.31 49.53,77.31 49.33,77.51 PCB1.6 48.1,77.31 48.1,74.14 | 54.13,77.31 59.37,77.31 | 59.37,77.31 66.2,77.31 | 66.99,77.31 74.77,77.31 | 74.77,77.31 79.85,77.31 | 79.85,77.31 84.77,77.31 | 84.77,77.31 91.19,77.31 | 54.41,77.04 54.13,77.31 | PCB1.14 59.49,77.43 59.37,77.31 | PCB1.20 67.11,77.43 66.99,77.31 | 74.77,77.31 74.73,77.27 PCB1.25 | PCB1.30 79.81,77.36 79.85,77.31 | PCB1.34 84.89,77.43 84.77,77.31 | 83.03,16.03 83.03,14.13 84.45,12.7 v84.45,6.35 84.45,5.87 83.82,5.24 81.91,5.24 C34.2 | v83.19,16.19 87.31,16.19 v92.23,11.27 93.82,9.68 v93.82,7.78 | 66.99,77.31 66.2,77.31 | 66.2,77.31 65.88,76.99 65.88,74.3 | 29.84,61.59 29.84,57.47 | 29.84,57.47 29.84,52.39 | v62.23,61.75 62.07,61.75 v57.15,66.67 | SV3.4 29.84,57.47 | v22.54,29.37 21.11,29.37 18.73,31.75 18.73,32.23 19.37,32.86 20.95,32.86 21.43,32.38 22.54,32.38 v23.5,33.34
  Bottom 0.61: v2.86,61.44 10.79,61.44 v10.16,61.91
  Bottom 0.813: 50.8,46.04 49.21,47.62 45.72,47.62 44.29,49.05 44.29,61.44 v48.58,65.72 48.58,68.58 | v53.5,5.24 53.66,5.08 v59.05,10.48 58.9,10.32 58.9,10.23 62.39,13.73 v62.39,17.62 | U$4.P$9B v80.49,21.91 | 48.58,68.58 46.83,68.58 45.4,70.01 45.32,70.09 48.1,72.87 48.1,74.14 | 48.58,68.58 55.24,68.58 v57.15,66.67 | ZD1B4.A ZD1B3.A ZD1B2.A | v48.58,45.09 49.85,45.09 50.8,46.04 | SV1.6 29.84,69.22 29.84,61.59 | 65.88,74.3 v67.15,73.03 | 50.8,46.04 50.8,43.02 53.02,40.8 v53.02,38.42 | RS232.1 46.67,16.51 38.89,16.51 38.58,16.83 I2C.1 | R_A2IN2.1 11.27,15.4 11.59,15.08 | v16.19,16.99 16.19,15.24 16.35,15.08 | v21.11,16.51 21.11,15.24 21.27,15.08 | R_PWMA2.2 26.04,15.4 25.72,15.08 | 91.19,77.31 PCB1.39
  Bottom 1.27: v34.61,70.01 45.4,70.01 | X2.2 16.61,1.96 14.29,4.29 9.05,4.29 6.43,6.91 | 6.43,6.91 3.02,10.32 v3.02,15.56 3.02,27.62 3.97,28.57 X7.3 | SV2.10 8.73,9.21 6.43,6.91 | v30.8,15.08 25.72,15.08 21.27,15.08 16.35,15.08 11.59,15.08 8.89,15.08 | 8.89,15.08 SV2.9 | v8.41,15.08 8.89,15.08
  other vias: 55.24,44.77 55.72,34.29 58.1,38.26 83.03,58.47 88.11,52.55 29.69,64.93 17.46,60.48 80.17,6.99 11.27,17.62 26.04,15.72 8.73,78.74 2.06,71.28
  pour Top: 50.8,38.73 50.8,31.11 58.74,31.11 58.74,38.89 50.8,38.89
  pour Bottom (isolate 0.406): 50.8,38.89 50.8,31.11 58.74,31.11 58.74,38.89
  pour Top: 77.79,17.94 77.79,12.38 83.34,12.38 83.34,17.94
  pour Bottom (isolate 0.406): 77.63,17.94 77.63,12.22 83.5,12.22 83.5,17.94 77.79,17.94
  pour Bottom (isolate 0.406): 70.96,69.85 70.96,51.28 89.38,51.28 89.38,69.85
  pour Bottom (isolate 0.406): 0.32,81.12 34.61,81.12 34.61,27.78 0.32,27.78
  pour Bottom (isolate 0.406): 43.02,80.17 43.02,47.15 66.67,47.15 66.67,80.17
  pour Bottom (isolate 0.406): 63.34,46.83 63.34,26.67 101.6,26.67 101.6,46.83 63.5,46.83
N$2  (via drill 0.6)
  Top 0.406: IC1.34 58.93,44.64 v58.58,44.93 | v47.31,53.18 46.83,53.66 46.83,66.99 arc90 44.29,69.53 37.31,69.53 32.54,74.3 29.84,74.3 SV1.1
  Bottom 0.406: v58.58,44.93 55.4,48.1 52.39,48.1 v47.31,53.18
N$3
  Top 0.406: PCB1.8 50.64,77.31 50.64,64.93 48.74,63.02 R3RPI2.2
N$5
  Top 0.305: IC3.3 20.8,68.1 20,67.31 R4A.1
N$6
  Top 0.813: L1B.2 3.49,46.35 5.56,44.29 F1B.1
N$7
  Top 0.813: L1A.2 44.46,71.44 F1A.1
N$10
  Top 0.813: R_SHORT1.1 16.51,30.48 16.51,32.75 LED2.C
N$11
  Top 0.305: U$8.6 18.57,38.1 CI2.1
N$13
  Top 0.254: IC7.8 86.03,15.83 R1.2
N$14
  Top 0.254: IC7.7 88.04,15.33 88.9,16.19 88.9,18.89 88.11,19.68 R2.2
N$15
  Top 0.406: Q1.B 63.19,63.34 64.45,62.07 R1RPI.1 64.29,60.64 62.39,58.74 ZD1B14.C
N$16
  Top 0.406: X12.D+ 91.76,18.73 90.33,20.16 R2.1 R3.1
N$17
  Top 0.406: X12.D- 90.65,17.94 90.3,17.59 R1.1
N$18
  Top 0.305: Q4.1 60.1,61.68 61.75,63.34 61.75,66.2 62.87,67.31 64.12,67.31 Q1.C R2RPI.1
N$19
  Top 0.305: LED1.C 53.18,59.06 R3RPI.2
N$20
  Top 0.406: D1B.K 9.35,56.5 9.37,57.15 IC4.1
  Top 0.813: L2B.2 3.81,53.98 6.63,53.98 6.64,53.96 8.1,55.4 8.1,56.2 8.57,56.67 9.38,56.67 D1B.K
N$21
  Top 0.254: IC7.5 83.62,14.33 82.23,15.72 82.23,16.67 85.88,20.32 85.88,21.11 86.84,22.07 R3.2
N$22  (via drill 0.6)
  Top 0.406: L2B.1 3.51,57.93 v3.49,57.94
  Top 0.61: L2B.1 6.21,60.01 v7.78,60.01 7.78,62.07 | R1B.2 15.4,67.63 14.61,68.42 8.73,68.42 7.78,67.47 7.78,62.07 | C2B.+ 7.78,62.07
  Top 0.813: v3.49,50.65 v3.49,50.64 L1B.1
  Bottom 0.813: v3.49,57.94 v3.49,50.64
N$23
  Top 0.406: R1A.1 23.5,76.2 | 23.5,76.2 22.48,76.2 IC3.5 | 23.5,76.2 23.5,74.76 R2A.2
N$25
  Top 0.406: LED3.C 16.4,43.77 16.51,43.81 16.51,46.84 R3RPI1.2
N$26
  Top 0.305: C4B.2 16.03,53.34 R3B.2 15.24,53.33
  Top 0.406: R3B.2
N$27  (via drill 0.6)
  Top 0.305: IC2.9 80.33,69.53 80.64,69.22 83.82,69.22 v85.41,67.63
  Bottom 0.305: v85.41,67.63 R_SIM5.1
N$28
  Top 0.254: IC7.14 82.89,21.8 C29.1 | 83.47,22.51 83.5,22.38 83.5,22.54 85.41,22.54 87.31,24.45 87.31,26.99 R7.1
  Top 0.406: 83.5,22.38 83.5,22.09 C29.1
N$29
  Top 0.406: IC3.1 14.68,69.63 L2A.2
  Top 0.61: L2A.2 16.51,70.64 | IC3.1 17.62,69.52 D1A.K
N$30
  Top 0.254: C4A.2 24.29,64.76 R3A.2
N$31
  Top 0.406: IC4.5 13.18,64.93 15.39,64.93 R1B.1 R2B.2
N$32  (via drill 0.6)
  Top 0.305: IC2.26 v71.44,60.33
  Bottom 0.305: v71.44,60.33 72.87,60.33 76.68,64.14 76.68,66.04 79.53,68.9 97.95,68.9 X9.1
N$34  (via drill 0.6)
  Top 0.305: IC2.10 79.33,69.42 80.33,68.42 82.23,68.42 v83.03,67.63
  Bottom 0.305: v83.03,67.63 R_SIM6.1
N$37
  Top 0.406: LED_USB_FAULT.A 63.61,22.44 R_SHORT_USB.1
N$40  (via drill 0.6)
  Top 0.305: IC2.16 73.33,69.07 75.25,67.15 v80.01,67.15
  Bottom 0.305: v80.01,67.15 R_SIM7.1
N$41
  Top 0.406: PCB1.10 53.18,77.31 53.18,74.3 52.23,73.34 52.23,63.97 R3RPI3.2
N$42
  Top 0.61: X11.1 IC2.60
N$45
  Top 0.305: R_HEN1.1 20.32,29.21 19.84,28.73 6.5,28.73 OK_HEN.1
N$48
  Top 0.406: OK_HEN.3 R_HEN2.1 3.33,17.46 7.14,13.65 9.53,13.65 SV2.7
OPT_A1
  Top 0.406: OK_A2.3 R_A2IN2.2 13.17,14.29 13.97,13.49 SV2.5
OPT_A2
  Top 0.406: SV2.3 16.51,13.02 17.94,14.45 22.38,14.45 23.02,15.08 R_A1IN2.2 OK_A1.3
  Top 0.813: OK_A1.3
OPT_A_PWM
  Top 0.406: OK_PWMB.3 R_PWMA2.1 27.94,14.76 27.62,14.45 23.81,14.45 22.86,13.49 19.84,13.49 19.05,12.7 SV2.1
OPT_B1
  Top 0.406: OK_B2.3 R_B2IN2.2 8.25,17.15 12.7,12.7 12.7,10.48 SV2.6
OPT_B2
  Top 0.406: OK_B1.3 R_B1IN2.1 18.09,16.19 15.24,13.34 15.24,10.48 SV2.4
OPT_B_PWM
  Top 0.406: SV2.2 20.64,10.79 20.64,12.06 21.11,12.54 23.18,12.54 24.13,13.49 32.7,13.49 32.86,13.65 R_PWMB2.2 OK_PWMA.3
PA0  (via drill 0.6)
  Top 0.305: IC1.40 54.13,34.12 v54.61,33.5
  Bottom 0.305: v54.61,33.5 53.82,32.7 46.04,32.7 41.75,36.99 34.77,36.99 32.07,39.69 SV3.18
PA1
  Top 0.305: IC1.41 53.33,42.08 52.07,43.34 49.69,43.34 47.94,41.59 44.93,41.59 41.12,37.78 32.38,37.78 31.75,38.42 29.84,38.42 SV3.17
PA2
  Top 0.305: IC1.42 52.53,41.93 51.75,42.7 50.01,42.7 48.26,40.96 45.24,40.96 41.43,37.15 SV3.20
PA3
  Top 0.305: IC1.43 51.73,41.78 51.44,42.07 50.32,42.07 48.58,40.32 45.56,40.32 41.75,36.51 32.38,36.51 31.75,35.88 29.84,35.88 SV3.19
PA4
  Top 0.305: IC1.44 49.93,40.73 48.9,39.69 45.88,39.69 42.07,35.88 38.58,35.88 33.81,31.11 30.96,31.11 29.84,30 29.84,28.89 R_B1IN1.1
PA5
  Top 0.305: IC1.1 46.07,38.92 42.39,35.24 38.89,35.24 33.97,30.32 R_A2IN1.2
PA6
  Top 0.305: IC1.2 46.22,38.12 42.7,34.61 39.21,34.61 35.08,30.48 35.08,28.58 R_B2IN1.1
PA7
  Top 0.305: IC1.3 46.37,37.33 42.55,33.5 42.55,33.18 R_A1IN1.2
PB0  (via drill 0.6)
  Top 0.305: IC1.4 47.32,36.52 v47.15,36.35 | v42.23,40.64 37.78,40.64 32.38,46.04 29.84,46.04 SV3.13 25.09,41.28 R_PDIV1.1 P_PDIV2.2
  Bottom 0.305: v47.15,36.35 47.15,36.51 46.35,36.51 v42.23,40.64
PB1  (via drill 0.6)
  Top 0.305: IC1.5 v51.12,35.73 v51.12,35.72 | v41.12,39.69 37.15,39.69 32.07,44.77 SV3.14 | U$8.7 v20.8,39.37
  Bottom 0.305: v51.12,35.72 48.26,35.72 47.94,35.4 46.2,35.4 41.91,39.69 v41.12,39.69 | v20.8,39.37 22.38,40.96 24.77,40.96 27.3,43.5 29.84,43.5 SV3.14
PB2  (via drill 0.6)
  Top 0.305: IC1.6 47.31,34.92 v46.83,34.45 | v40.01,38.73 39.69,39.05 36.2,39.05 31.75,43.5 29.84,43.5 SV3.15
  Top 0.406: R_PWR2.2 25.4,30.96 | 25.4,30.96 R_PWR1.1 C6.1 | SV3.15 26.99,40.64 26.99,33.97 25.24,32.23 25.24,31.11 25.4,30.96
  Bottom 0.305: v46.83,34.45 46.2,34.45 41.91,38.73 v40.01,38.73
PB3  (via drill 0.6)
  Top 0.305: IC1.7 51.28,34.12 51.29,34.13 51.59,34.13 v51.91,34.45 | v34.29,39.05 SV3.16
  Bottom 0.305: v51.91,34.45 51.59,34.13 48.1,34.13 47.47,33.5 46.2,33.5 41.91,37.78 35.56,37.78 v34.29,39.05
PC0  (via drill 0.6)
  Top 0.305: IC1.10 48.39,31.73 v46.2,29.53 | v45.24,23.65 42.55,20.95 41.59,20.95 41.12,20.48 I2C.2
  Bottom 0.305: v46.2,29.53 46.2,24.61 v45.24,23.65
PC1  (via drill 0.6)
  Top 0.305: IC1.11 49.13,30.87 v47.78,29.53 | v46.83,23.65 43.66,20.48 I2C.3
  Bottom 0.305: v47.78,29.53 46.83,28.57 v46.83,23.65
PC4
  Top 0.305: IC1.14 52.53,30.18 52.23,30.48 50.48,30.48 48.42,28.42 R_PWMA1.1
PC5  (via drill 0.6)
  Top 0.305: IC1.15 53.33,27.13 v52.86,26.67 | v49.85,26.67 47.78,24.61 44.77,24.61 43.18,23.02 R_PWMB1.2
  Bottom 0.305: v52.86,26.67 v49.85,26.67
PC6  (via drill 0.6)
  Top 0.305: IC1.16 54.13,25.71 53.82,25.4 53.82,22.54 55.4,20.95 55.4,17.14 54.29,16.03 50.32,16.03 47.94,13.65 47.94,10.79 49.37,9.37 U$3.P$4 | U$4.P$12 76.68,6.03 65.41,6.03 64.29,7.14 56.67,7.14 55.24,8.57 v53.82,8.57
  Bottom 0.305: v53.82,8.57 53.66,8.57 52.86,9.37 U$3.P$4
PC7
  Top 0.305: IC1.17 54.93,25.56 54.45,25.08 54.45,22.7 55.4,21.75 56.67,21.75 57.94,20.48 57.94,17.3 56.04,15.4 50.64,15.4 48.58,13.34 48.58,11.27 49.21,10.64 51.91,10.64 52.39,10.16 52.39,6.83 | U$4.P$10 76.36,3.97 75.09,5.24 65.25,5.24 63.98,6.51 56.36,6.51 56.04,6.83 52.39,6.83 | 52.39,6.83 U$3.P$3
PD0  (via drill 0.6)
  Top 0.305: IC1.20 57.33,26.65 59.05,24.92 59.05,23.97 | 59.05,23.97 59.05,22.7 58.58,22.23 58.58,16.99 56.36,14.76 50.96,14.76 50.48,14.29 U$3.P$5 | v59.37,23.97 59.05,23.97
  Bottom 0.305: U$4.P$5B 71.12,21.91 69.85,23.18 60.33,23.18 59.53,23.97 v59.37,23.97
PD1  (via drill 0.6)
  Top 0.305: IC1.21 58.13,28.07 58.58,27.62 61.28,27.62 63.02,29.37 67.63,29.37 72.55,34.29 v72.55,38.26 | v69.37,46.99 v69.37,50.8 | v80.49,61.91 74.93,61.91 v73.98,62.87
  Bottom 0.305: v72.55,38.26 69.37,41.43 v69.37,46.99 | v69.37,50.8 69.37,61.28 69.69,61.59 72.39,61.59 73.66,62.87 v73.98,62.87 | R_SIM7.2 ZD1B2.C 80.53,61.87 v80.49,61.91
PD2  (via drill 0.6)
  Top 0.305: IC1.22 58.93,28.54 59.21,28.26 60.96,28.26 62.87,30.16 67.31,30.16 71.91,34.77 71.91,37.31 v70.17,39.05 | v67.94,48.26 v67.94,50.8 | v75.41,64.77 75.72,64.45 84.14,64.45 v85.41,63.18
  Bottom 0.305: v67.94,48.26 67.94,41.27 v70.17,39.05 | v67.94,50.8 67.94,61.91 68.42,62.39 71.91,62.39 73.5,63.98 74.61,63.98 v75.41,64.77 | R_SIM5.2 v85.41,63.18 ZD1B4.C
PD3  (via drill 0.6)
  Top 0.305: IC1.23 66.96,30.93 71.28,35.24 71.28,36.35 v70.17,37.47 | v66.52,49.53 v66.52,52.07 | v73.5,65.09 75.41,63.18 v83.03,63.18
  Bottom 0.305: v70.17,37.47 66.52,41.12 v66.52,49.53 | v66.52,52.07 66.52,61.91 67.79,63.18 71.28,63.18 73.18,65.09 v73.5,65.09 | R_SIM6.2 v83.03,63.18 ZD1B3.C
PD4  (via drill 0.6)
  Top 0.305: IC1.24 66.65,31.73 70.17,35.24 v70.17,35.88 | v65.56,62.87 66.04,62.39 66.04,55.4 63.18,52.55 v63.18,50.8 | v94.3,70.8 93.97,70.8 R_SIM4.2 94.46,70.17
  Bottom 0.305: v65.56,62.87 66.52,63.82 70.8,63.82 77.79,70.8 77.79,73.98 78.42,74.61 81.12,74.61 82.07,73.66 91.44,73.66 v94.3,70.8 ZD1B5.C | v70.17,35.88 63.18,42.86 v63.18,50.8
PD5
  Top 0.305: IC1.25 66.34,32.52 69.06,35.24 69.06,43.18 62.07,50.16 46.99,50.16 45.24,51.91 45.24,66.04 arc90 43.5,67.79 34.77,67.79 arc90 33.34,66.36 33.34,63.82 arc-90 30.96,61.44 30,61.44 arc90 SV3.1
PD6
  Top 0.305: IC1.26 66.03,33.33 68.26,35.56 68.26,42.86 61.75,49.37 46.51,49.37 44.45,51.44 44.45,65.72 arc90 43.02,67.15 35.08,67.15 arc90 33.97,66.04 33.97,62.87 arc-90 SV3.2
PD7
  Top 0.305: IC1.27 65.72,34.12 67.47,35.88 67.47,42.55 61.44,48.58 46.2,48.58 43.66,51.12 43.66,65.41 arc90 42.55,66.52 35.56,66.52 arc90 34.61,65.56 34.61,61.12 arc-90 32.23,58.74 29.84,58.74 arc90 SV3.3
PE0  (via drill 0.6)
  Top 0.305: IC1.28 65.41,34.92 66.67,36.2 66.67,42.23 61.12,47.78 45.72,47.78 42.86,50.64 42.86,64.93 arc90 41.91,65.88 36.04,65.88 arc90 35.24,65.09 35.24,59.85 arc-90 32.07,56.2 26.83,56.2 v23.5,59.53 ZD2A.C | R4A.2 v20,64.61
  Bottom 0.305: v20,64.61 20,63.02 v23.5,59.53
PE1
  Top 0.305: IC1.29 65.09,35.73 65.88,36.51 65.88,41.91 60.8,46.99 45.4,46.99 42.07,50.32 42.07,64.61 arc90 41.59,65.09 36.35,65.09 arc90 36.04,64.77 36.04,57.94 arc-90 31.75,53.66 27.62,53.66 27.15,54.13
  Top 0.406: R_RPI2.1 24.77,56.52 27.15,54.13
PE2  (via drill 0.6)
  Top 0.305: 48.41,54.61 R3RPI2.1
  Top 0.406: IC1.32 61.94,38.12 62.23,38.42 62.23,39.69 v61.44,40.48 | v61.75,51.28 61.59,51.12 51.12,51.12 48.42,53.82 48.42,54.62 R3RPI2.1
  Bottom 0.406: v61.44,40.48 61.59,51.12 v61.75,51.28
PE3  (via drill 0.6)
  Top 0.406: IC1.33 60.73,39.6 60.33,40.01 v60.33,41.75 | v60.96,52.7 60.17,51.91 51.92,51.91 50.96,52.87 R3RPI3.1
  Bottom 0.406: v60.33,41.75 60.33,43.5 60.64,43.81 60.64,52.86 v60.96,52.7
PR0  (via drill 0.6)
  Top 0.406: IC1.36 57.33,42.53 v56.99,42.86 | v60.8,54.29 62.31,55.8 | 62.31,55.8 64.14,57.63 R1RPI.2 | 62.23,55.88 62.31,55.8
  Bottom 0.406: v56.99,42.86 58.26,42.86 59.69,44.29 59.69,53.18 v60.8,54.29
PR1  (via drill 0.6)
  Top 0.305: IC1.37 56.53,39.52 56.83,39.21 v56.83,37.31 | v47.15,42.55 43.97,42.55 v43.18,41.75 | v20.48,31.43 R_HEN1.2
  Bottom 0.305: v56.83,37.31 56.67,37.31 56.04,36.67 53.02,36.67 v47.15,42.55 | v43.18,41.75 41.91,41.75 40.8,40.64 33.34,40.64 33.02,40.96 27.15,40.96 25.72,39.53 25.72,32.38 24.77,31.43 v20.48,31.43
PWMA
  Top 0.305: R_PWMB1.1 36.36,23.02 OK_PWMA.1
PWMB
  Top 0.305: R_PWMA1.2 44.13,25.88 42.86,24.61 37.62,24.61 36.67,25.56 30.16,25.56 OK_PWMB.1
PWR  (via drill 0.6)  (1 unrouted)
  Top 0.406: X7.2 4.92,33.34 | U$8.1 10.01,39.53 10,40.01 | F1B1.2 60.96,20.91 LED_USB_FAULT.C 60.21,21.54 v60.17,21.59
  Top 0.813: 4.92,33.34 6.51,34.92 6.51,38.58 | 6.51,38.58 7.94,40.01 10,40.01 | X6.1 5.72,39.37 6.51,38.58
  Bottom 0.813: v60.17,21.59 59.37,22.38 37.15,22.38 35.4,24.13 9.68,24.13 8.26,25.56 8.26,31.11 6.03,33.34 X7.2
PWR_H  (via drill 0.6)
  Top 0.406: U$8.3 10.01,37.47 U$8.4
  Top 0.813: U$8.4 10.01,35.07 F1.1 9.54,34.61 12.7,34.61 13.22,34.09 LED2.A
  Top 1.27: X2.1 10.58,1.96 v1.11,11.43 v1.11,12.7 v1.11,13.97 | v8.1,37.62 9.85,37.62 10.01,37.47
  Bottom 1.27: v1.11,11.43 v1.11,12.7 v1.11,13.97 1.11,36.83 1.91,37.62 v8.1,37.62
PWR_USB  (via drill 0.6)
  Top 0.406: D3.C v79.69,24.13 | F1B1.1 63.25,25.47 v63.5,25.56 R_SHORT_USB.2
  Bottom 0.406: v79.69,24.13 79.22,24.13 77.63,25.72 63.66,25.72 v63.5,25.56
RPI_3V3  (via drill 0.6)
  Top 0.406: v63.34,80.01 63.34,77.22 PCB1.17 | Q3.2 Q3.4 21.59,53.82 v21.43,53.98
  Top 0.813: Q3.2 21.59,45.88 19.84,44.13 LED3.A
  Bottom 0.406: 45.56,77.31 45.56,79.69 46.04,80.17
  Bottom 0.61: 46.04,80.17 63.18,80.17 v63.34,80.01
  Bottom 0.813: 45.56,77.31 PCB1.1 40.96,72.71 36.2,72.71 34.77,74.14 34.77,76.04 32.7,77.95 27.62,77.95 24.77,75.09 24.77,57.94 22.86,56.04 22.86,53.98 v21.43,53.98
RPI_5V
  Top 0.305: 60.8,74.77 60.8,79.69 | 53.15,53.89 LED1.A
  Top 0.406: PCB1.2 45.24,78.53 | 57.78,60.8 Q4.2
  Top 0.61: PCB1.4 45.24,78.53 45.48,78.3 45.48,79.45 46.2,80.17 60.33,80.17 60.8,79.69
  Top 0.813: Q4.2 Q4.4 53.15,53.89 | 60.8,74.77 60.8,63.82 57.78,60.8
RPI_CTRL_3V3
  Top 0.406: R_RPI2.2 19.37,56.52 18.73,55.88 | 18.73,55.88 18.73,48.09 Q3.1 | ZD1B15.C 18.73,55.88
SIM900PWRKEY
  Top 0.305: IC2.1 88.33,73.09 88.9,73.66 93.97,73.66 R_SIM4.1
SIM_CLK
  Top 0.305: IC2.32 70.45,54.33 71.28,53.5 71.28,51.59 70.48,50.8 70.48,46.83 72.23,45.09 R_SIM3.1
SIM_DTA
  Top 0.305: IC2.31 69,55.24 67.15,55.24 64.29,52.39 64.29,49.21 71.12,42.39 71.12,41.75 72.55,40.32 R_SIM1.2
SIM_DTA_S  (via drill 0.6)
  Top 0.305: R_SIM1.1 75.56,40.01 IC6.5 | v98.9,40.32 U$7.C7 100.65,40.32
  Bottom 0.305: R_SIM1.1 76.04,40.32 75.25,41.12 75.25,48.58 77.31,50.64 85.57,50.64 87.63,48.58 87.63,41.75 89.06,40.32 v98.9,40.32
  other vias: 75.88,40.32
SIM_RST
  Top 0.305: IC2.33 66.5,53.33 65.09,51.91 65.09,49.53 71.91,42.7 R_SIM2.2
SIM_VCC
  Top 0.305: IC2.30 70.99,56.33 71.91,55.4 71.91,51.28 71.28,50.64 71.28,47.47 71.91,46.83 84.45,46.83 84.77,46.51 84.77,45.09 85.41,44.45 89.22,44.45 89.85,43.81 89.85,36.35 88.74,35.24 U$7.C1 85.41,35.24 85.09,34.92 85.09,30.19 C21.1
SIMCLS_S  (via drill 0.6)
  Top 0.305: R_SIM3.2 v77.15,45.09 77.31,44.93 77.31,38.89 76.22,37.8 IC6.4 | v86.04,40.32 U$7.C3
  Bottom 0.305: v77.15,45.09 77.15,48.42 77.79,49.05 85.09,49.05 86.36,47.78 86.36,40.64 v86.04,40.32
SIMRSTS  (via drill 0.6)
  Top 0.305: v76.2,42.7 R_SIM2.1 74.93,42.7 74.45,42.23 74.45,38.42 74.92,37.96 IC6.6 | v88.42,37.78 U$7.C2
  Bottom 0.305: v76.2,42.7 76.2,48.42 77.63,49.85 85.41,49.85 87,48.26 87,39.21 v88.42,37.78
V_H_LOG  (via drill 0.6)
  Top 0.406: 10.79,22.07 6.03,22.07 6.03,21.11 OK_HEN.4 | 10.79,22.07 OK_B2.4 | OK_A2.4 15.72,22.07 | 15.72,22.07 10.79,22.07 | OK_B1.4 20.8,19.2 20.8,20.16 | 20.8,20.16 18.89,22.07 15.72,22.07 | OK_A1.4 25.4,18.57 25.4,20.16 | 25.4,20.16 20.8,20.16 | OK_PWMB.4 30.48,20.16 | 30.48,20.16 25.4,20.16 | OK_PWMA.4 35.4,20.16 30.48,20.16 | 10.16,10.48 8.1,10.48 v5.87,12.7
  Top 0.813: SV2.8 10.16,10.48
  Bottom 0.406: 20,1.11 17.14,3.97 16.67,3.97 SV2.8 | v5.87,12.7 OK_HEN.4
  Bottom 1.27: IC5.OUT 20.95,1.11 20,1.11
  other vias: 5.87,21.11
V_USB  (via drill 0.6)
  Top 0.254: R5.2 99.06,10.66 v99.06,9.05 L6.2
  Top 0.305: ZD_USB.C 90.12,14.56 91.6,16.03 91.6,16.83 91.92,17.14 | 91.92,17.14 91.72,16.95 | 91.92,17.14 X12.VBUS
  Top 0.406: 95.71,17.93 v97,17.94 | X12.VBUS 94.92,17.13 v95.73,17.94 | C27.+ v92.87,2.7 | v83.82,24.13 D3.A
  Bottom 0.406: v92.87,2.7 93.66,3.49 93.66,6.03 96.2,8.57 98.58,8.57 v99.06,9.05 99.06,15.08 v97,17.94 | v95.73,17.94 v97,17.94 | v97,17.94 97,21.91 94.77,24.13 v83.82,24.13

## Text on the board
Top: 12V | 4V4 | 3V3 | USB | 2017 | Adam Kaliszan
Bottom: 2017 | Adam Kaliszan